# Altium schematic sheet Distance-Sensors.SchDoc: Distance Sensor Interface
size A; Organization: MIL; Address1: Level-shifting circuitry for ToF; Address2: and headers for both ToF and; Address3: ultrasonic sensors; Revision: 0; SheetNumber: 2; SheetTotal: 2; Project: Distance Sensor Interface; Author1: Aiden Shepler
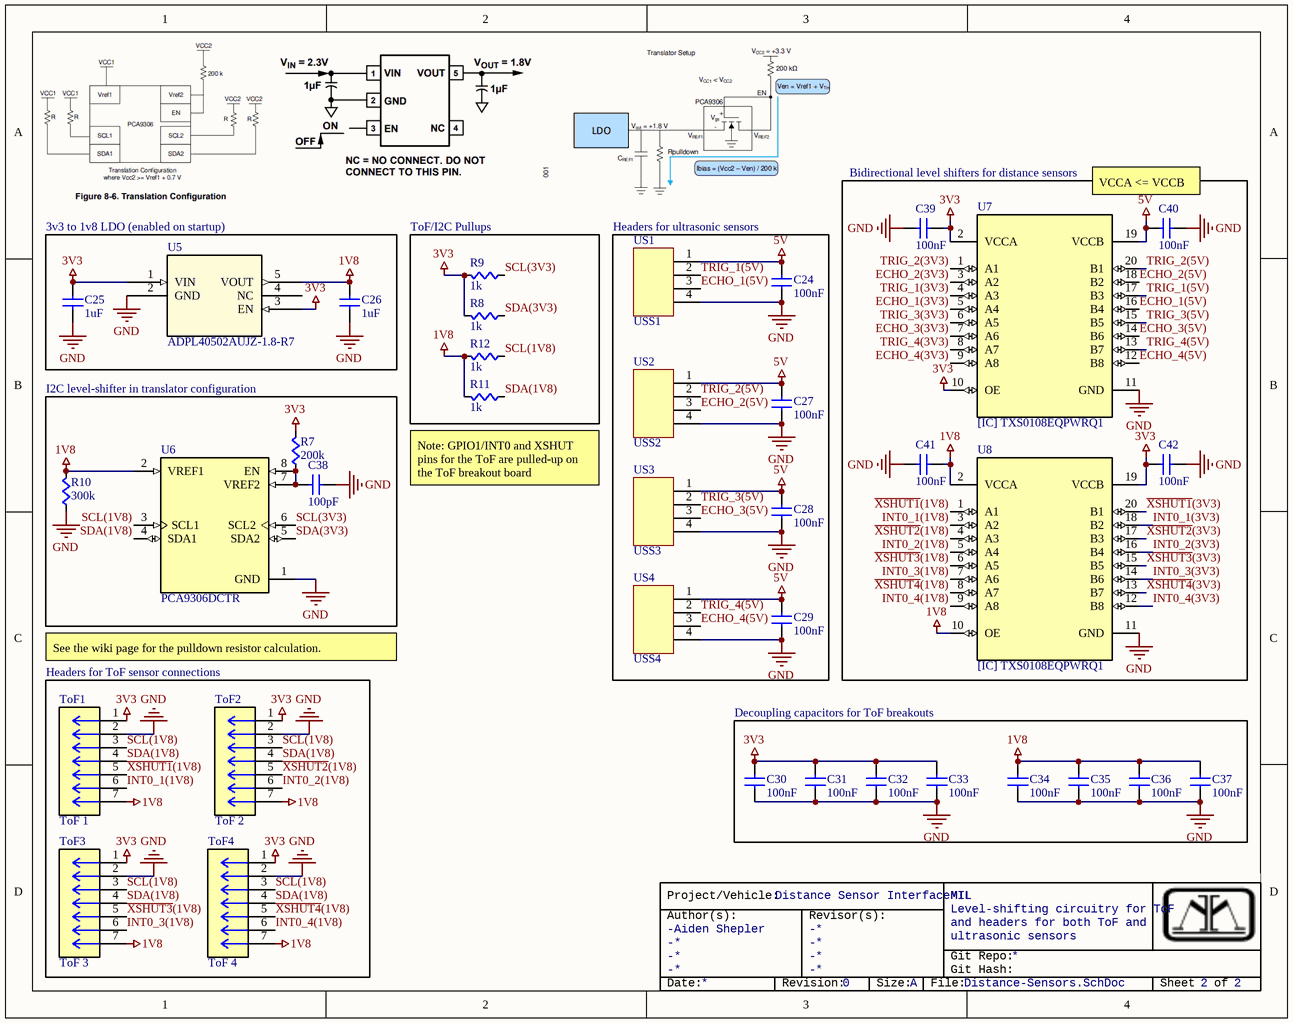
[diagram p0: Distance-Sensors.SchDoc]

## Parts
C24  value 100nF  [CAPC0603]  (hidden comment: Cap)
C25  value 1uF  [CAPC0603]  (hidden comment: Cap)
C26  value 1uF  [CAPC0603]  (hidden comment: Cap)
C27  value 100nF  [CAPC0603]  (hidden comment: Cap)
C28  value 100nF  [CAPC0603]  (hidden comment: Cap)
C29  value 100nF  [CAPC0603]  (hidden comment: Cap)
C30  value 100nF  [CAPC0603]  (hidden comment: Cap)
C31  value 100nF  [CAPC0603]  (hidden comment: Cap)
C32  value 100nF  [CAPC0603]  (hidden comment: Cap)
C33  value 100nF  [CAPC0603]  (hidden comment: Cap)
C34  value 100nF  [CAPC0603]  (hidden comment: Cap)
C35  value 100nF  [CAPC0603]  (hidden comment: Cap)
C36  value 100nF  [CAPC0603]  (hidden comment: Cap)
C37  value 100nF  [CAPC0603]  (hidden comment: Cap)
C38  value 100pF  [CAPC0603]  (hidden comment: Cap)
C39  value 100nF  [CAPC0603]  (hidden comment: Cap)
C40  value 100nF  [CAPC0603]  (hidden comment: Cap)
C41  value 100nF  [CAPC0603]  (hidden comment: Cap)
C42  value 100nF  [CAPC0603]  (hidden comment: Cap)
R7  value 200k  [RES0603]  (hidden comment: Res)
R8  value 1k  [RES0603]  (hidden comment: Res)
R9  value 1k  [RES0603]  (hidden comment: Res)
R10  value 300k  [RES0603]  (hidden comment: Res)
R11  value 1k  [RES0603]  (hidden comment: Res)
R12  value 1k  [RES0603]  (hidden comment: Res)
ToF1  ToF 1  [7POS_2MM_CONN]
ToF2  ToF 2  [7POS_2MM_CONN]
ToF3  ToF 3  [7POS_2MM_CONN]
ToF4  ToF 4  [7POS_2MM_CONN]
U5  ADPL40502AUJZ-1.8-R7  [TSOT-23-5_UJ-5_ADI]
U6  PCA9306DCTR  [SOP65P400X130-8N]
U7  [IC] TXS0108EQPWRQ1  [SOP65P640X120-20N]
U8  [IC] TXS0108EQPWRQ1  [SOP65P640X120-20N]
US1  USS1  [MOLEX-HDR-1X4-SHERLOCK-VERT]
US2  USS2  [MOLEX-HDR-1X4-SHERLOCK-VERT]
US3  USS3  [MOLEX-HDR-1X4-SHERLOCK-VERT]
US4  USS4  [MOLEX-HDR-1X4-SHERLOCK-VERT]

## Blocks framed on the sheet
Bidirectional level shifters for distance sensors: C39-C42 U7 U8
3v3 to 1v8 LDO (enabled on startup): C25 C26 U5
ToF/I2C Pullups: R8 R9 R11 R12
Headers for ultrasonic sensors: C24 C27-C29 US1-US4
I2C level-shifter in translator configuration: C38 R7 R10 U6
Headers for ToF sensor connections: ToF1-ToF4
Decoupling capacitors for ToF breakouts: C30-C37

## Nets
1V8: C26.1(A) C34.1(A) C35.1(A) C36.1(A) C37.1(A) C41.2(B) R10.1(A) R11.1(A) R12.1(A) ToF1.7 ToF2.7 ToF3.7 ToF4.7 U5.5(VOUT) U6.2(VREF1) U8.2(VCCA) U8.10(OE)
3V3: C25.1(A) C30.1(A) C31.1(A) C32.1(A) C33.1(A) C39.2(B) C42.2(B) R7.1(A) R8.1(A) R9.1(A) ToF1.1 ToF2.1 ToF3.1 ToF4.1 U5.1(VIN) U5.3(EN) U7.2(VCCA) U7.10(OE) U8.19(VCCB)
5V: C24.1(A) C27.1(A) C28.1(A) C29.1(A) C40.1(A) U7.19(VCCB) US1.1 US2.1 US3.1 US4.1
GND: C24.2(B) C25.2(B) C26.2(B) C27.2(B) C28.2(B) C29.2(B) C30.2(B) C31.2(B) C32.2(B) C33.2(B) C34.2(B) C35.2(B) C36.2(B) C37.2(B) C38.2(B) C39.1(A) C40.2(B) C41.1(A) C42.1(A) R10.2(B) ToF1.2 ToF2.2 ToF3.2 ToF4.2 U5.2(GND) U6.1(GND) U7.11(GND) U8.11(GND) US1.4 US2.4 US3.4 US4.4
ECHO_1(3V3): U7.5(A4)
ECHO_1(5V): U7.16(B4) US1.3
ECHO_2(3V3): U7.3(A2)
ECHO_2(5V): U7.18(B2) US2.3
ECHO_3(3V3): U7.7(A6)
ECHO_3(5V): U7.14(B6) US3.3
ECHO_4(3V3): U7.9(A8)
ECHO_4(5V): U7.12(B8) US4.3
INT0_1(1V8): ToF1.6 U8.3(A2)
INT0_1(3V3): U8.18(B2)
INT0_2(1V8): ToF2.6 U8.5(A4)
INT0_2(3V3): U8.16(B4)
INT0_3(1V8): ToF3.6 U8.7(A6)
INT0_3(3V3): U8.14(B6)
INT0_4(1V8): ToF4.6 U8.9(A8)
INT0_4(3V3): U8.12(B8)
SCL(1V8): R12.2(B) ToF1.3 ToF2.3 ToF3.3 ToF4.3 U6.3(SCL1)
SCL(3V3): R9.2(B) U6.6(SCL2)
SDA(1V8): R11.2(B) ToF1.4 ToF2.4 ToF3.4 ToF4.4 U6.4(SDA1)
SDA(3V3): R8.2(B) U6.5(SDA2)
TRIG_1(3V3): U7.4(A3)
TRIG_1(5V): U7.17(B3) US1.2
TRIG_2(3V3): U7.1(A1)
TRIG_2(5V): U7.20(B1) US2.2
TRIG_3(3V3): U7.6(A5)
TRIG_3(5V): U7.15(B5) US3.2
TRIG_4(3V3): U7.8(A7)
TRIG_4(5V): U7.13(B7) US4.2
~{XSHUT1}(1V8): ToF1.5 U8.1(A1)
~{XSHUT1}(3V3): U8.20(B1)
~{XSHUT2}(1V8): ToF2.5 U8.4(A3)
~{XSHUT2}(3V3): U8.17(B3)
~{XSHUT3}(1V8): ToF3.5 U8.6(A5)
~{XSHUT3}(3V3): U8.15(B5)
~{XSHUT4}(1V8): ToF4.5 U8.8(A7)
~{XSHUT4}(3V3): U8.13(B7)
NetC38_1: C38.1(A) R7.2(B) U6.7(VREF2) U6.8(EN)

Not connected (* = marked no-connect by the designer): U5 4(NC)

## Notes on the sheet
- VCCA <= VCCB
- (near R11) Note: GPIO1/INT0 and XSHUT pins for the ToF are pulled-up on the ToF breakout board
- See the wiki page for the pulldown resistor calculation.
- Project/Vehicle:
- Author(s):
- -
- Revisor(s):
- Git Repo:
- Git Hash:
- Date:
- Revision:
- Size:
- A
- File:
- Sheet
- of

## Library data of the parts
R7-R12 = Res: SMD, RES0603; Supplier 1: Digi-Key; Supplier Part Number 1: RMCF0603JT10K0CT-ND
ToF1-ToF4 = MOLEX_SHERLOCK_1x7_CONN: 1x7 2mm pitch sherlock connector; MP: 353620750; Package: None; Price: None; Value: *; Availability: Unavailable
U5 = ADPL40502AUJZ-1.8-R7: Low Noise, 200mA, CMOS Linear Regulator (LDO); Manufacturer_Name: Analog Devices Inc; Copyright: Copyright (C) 2025 Ultra Librarian. All rights reserved.; Manufacturer_Part_Number: ADPL40502AUJZ-1.8-R7; RefDes: RefDes; Type: Type
U6 = PCA9306DCTR: 2-bit bidirectional 400-kHz I2C/SMBus voltage level translator; MF: Texas Instruments; SnapEDA_Link: https://www.snapeda.com/parts/PCA9306DCTR/Texas+Instruments/view-part/?ref=snap; Package: SSOP-8 Texas Instruments; Value: *; MP: PCA9306DCTR; Check_prices: https://www.snapeda.com/parts/PCA9306DCTR/Texas+Instruments/view-part/?ref=eda
U7 U8 = [IC] TXS0108EQPWRQ1: Automotive eight-bit bidirectional voltage level shifter for open-drain and push-pull applications; MF: Texas Instruments; SnapEDA_Link: https://www.snapeda.com/parts/TXS0108EQPWRQ1/Texas+Instruments/view-part/?ref=snap; Package: TSSOP-20 Texas Instruments; Value: *; MP: TXS0108EQPWRQ1; Check_prices: https://www.snapeda.com/parts/TXS0108EQPWRQ1/Texas+Instruments/view-part/?ref=eda; ComponentLink1Description: DigiKey_Link; ComponentLink1URL: https://www.digikey.com/en/products/detail/texas-instruments/TXS0108EQPWRQ1/5324256?s=N4IgTCBcDaICoA0DKAGAjCgHAUQIoAUB1AJVzRAF0BfIA
US1-US4 = MOLEX-HDR-1x4-SHERLOCK_VERT: Header, Molex, 2mm Pitch Sherlock Header, Single Row, Vertical, 4 Circuits, Length 3.3mm, 0353620450; Manufacturer Part Number: *; Order Part Number: *
C24-C42 = Cap: Supplier 1: Digi-Key; Supplier Part Number 1: 1276-1000-1-ND